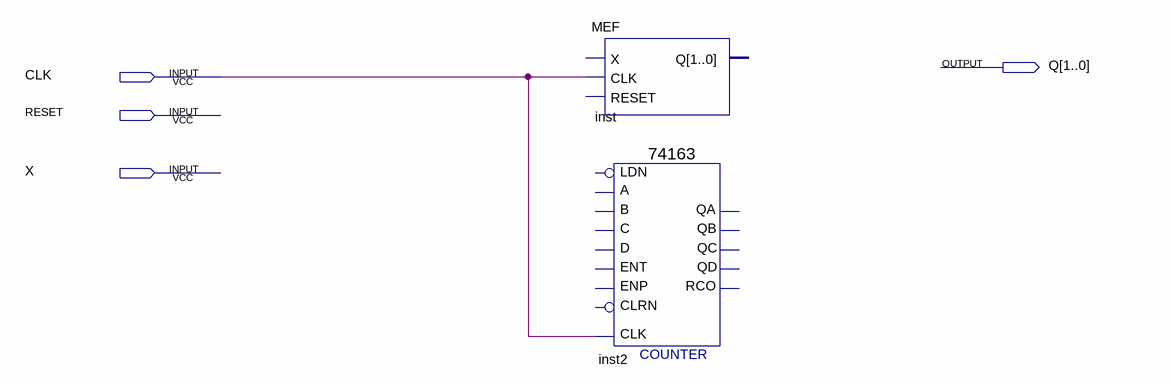
[diagram p0: schematic sheet]
// Quartus schematic SpecialCount.bdf as structural Verilog: 2 symbols, 4 pins
module SpecialCount (
  input  CLK,
  input  RESET,
  input  X,
  output [1:0] Q
);

  MEF inst (.CLK(CLK));  // open: X, RESET, Q
  \74163  inst2 (.CLK(CLK));  // open: C, B, A, ENT, D, CLRN, ENP, LDN, QA, QB, QC, QD, RCO
endmodule
